# Altium project PMP20873E1.PrjPcb (part 3 of 4)
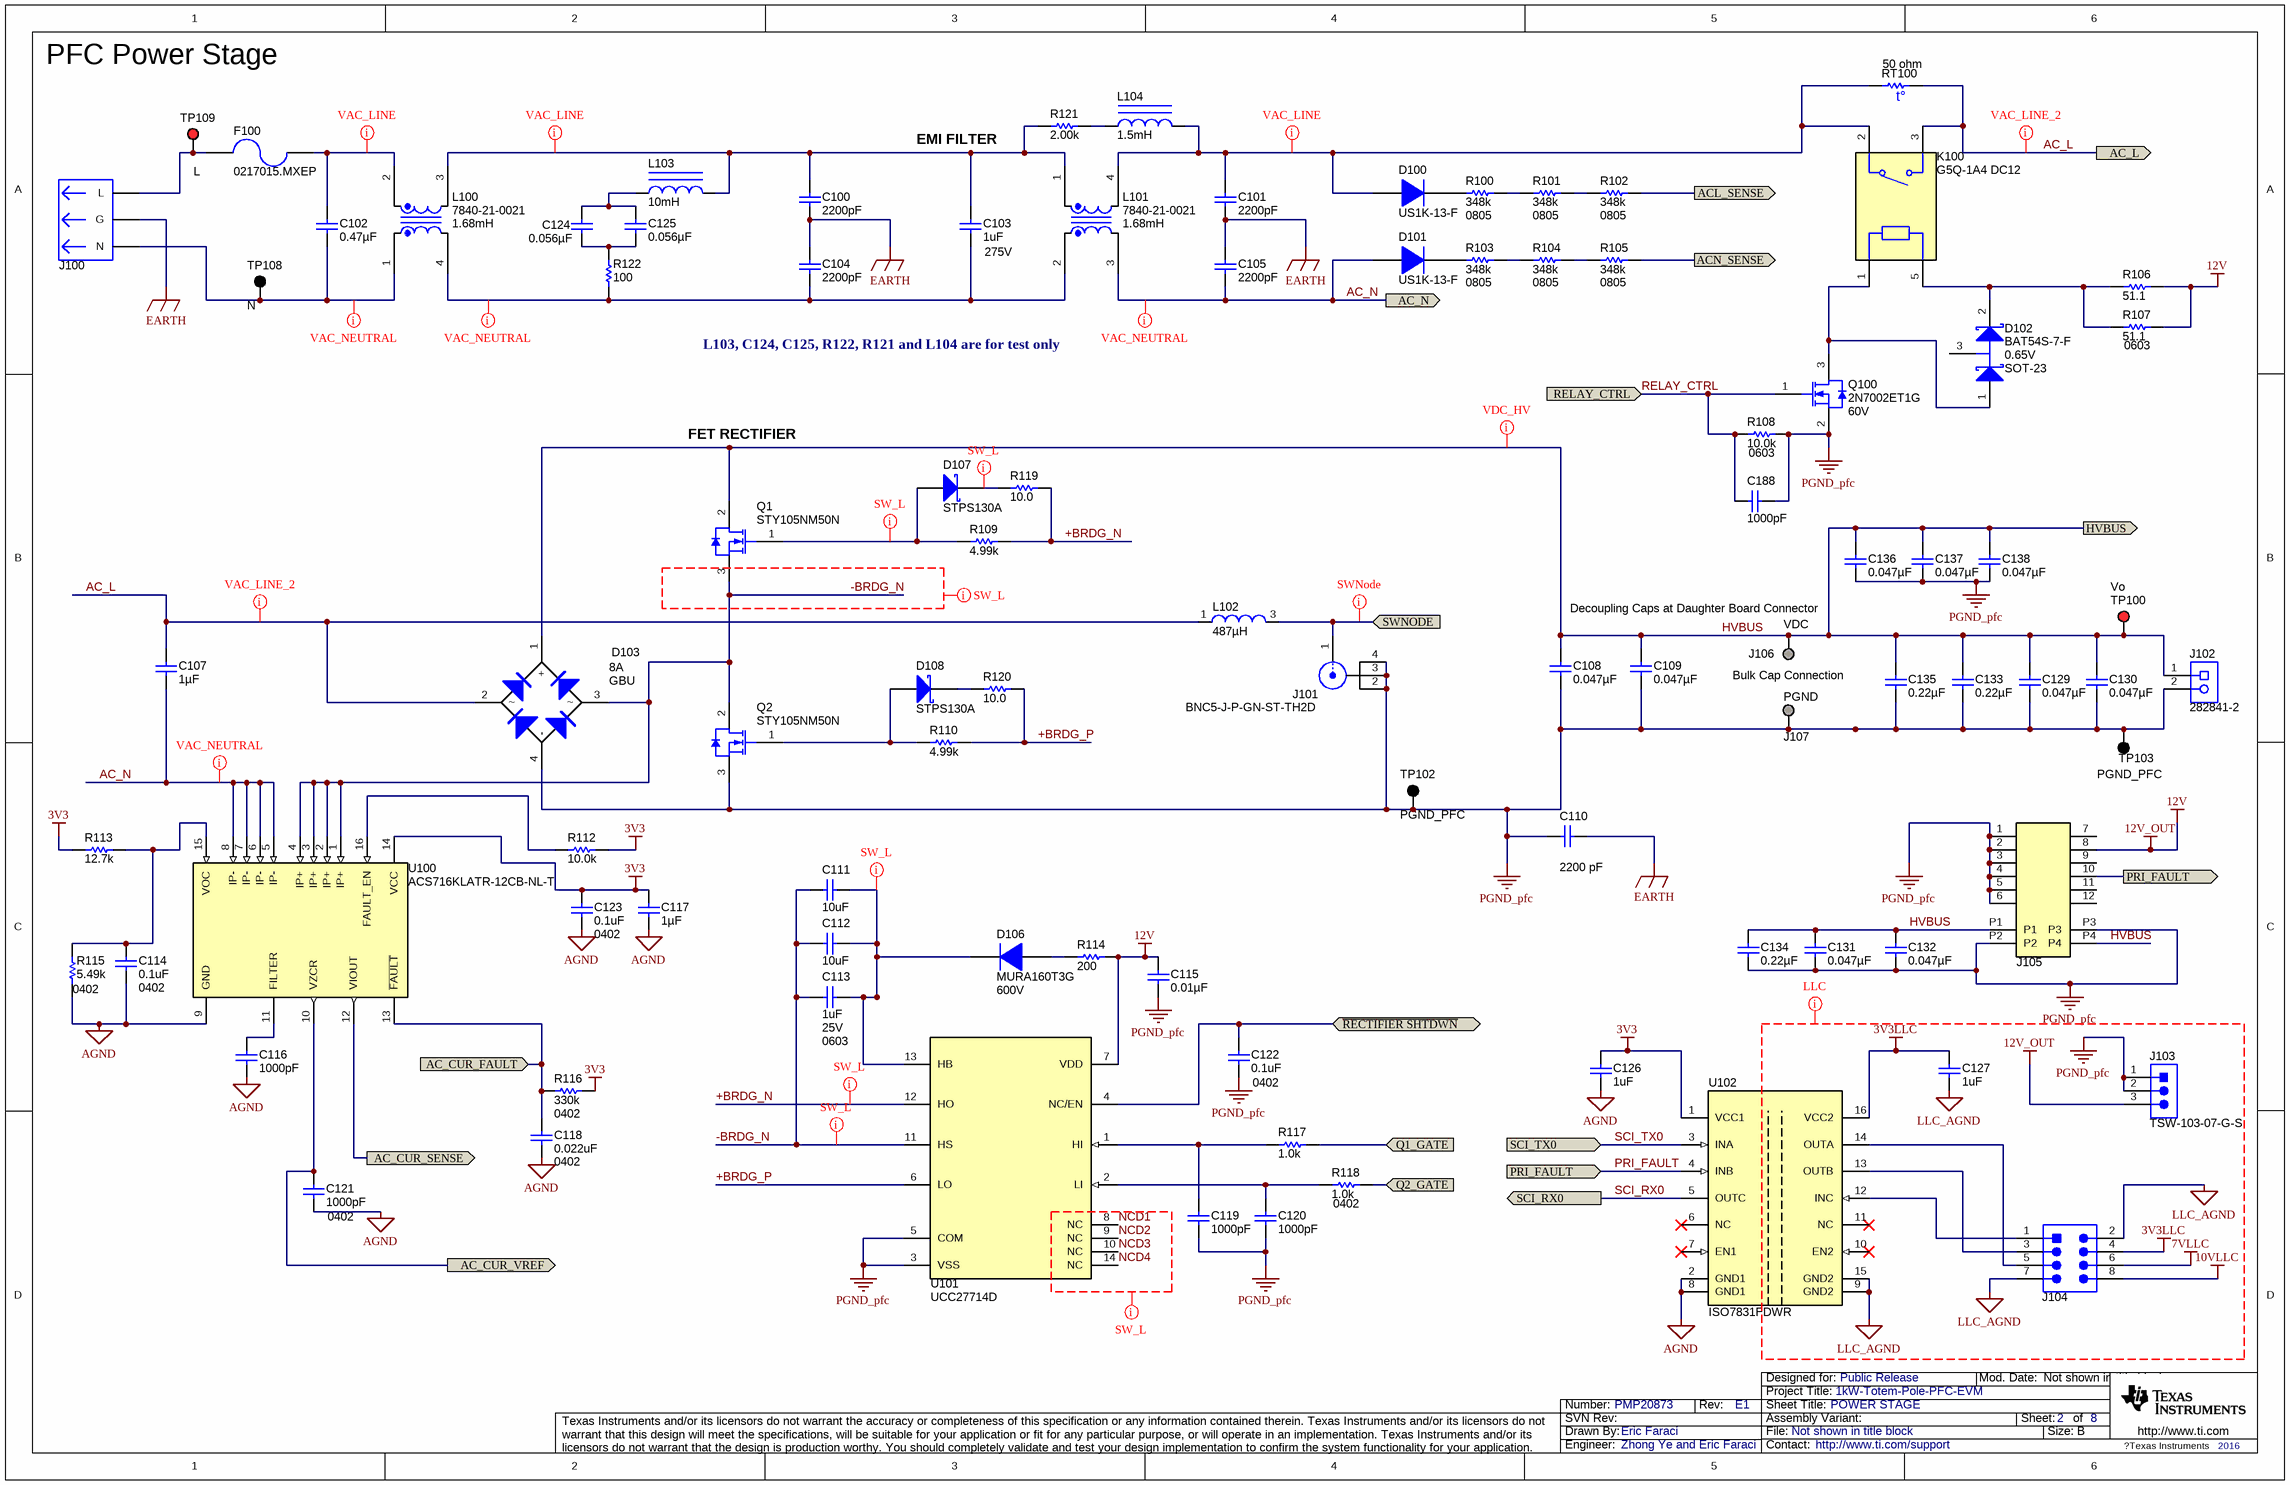
[diagram p4: PMP20873E1_Power.SchDoc]

## Sheet PMP20873E1_Power.SchDoc: POWER STAGE (continued)

### Parts
C100  ValueDisplayed: 2200pF  [CAPRD500W60D800H850]  (hidden comment: DE2E3KY222MA2BM01)
C101  ValueDisplayed: 2200pF  [CAPRD500W60D800H850]  (hidden comment: DE2E3KY222MA2BM01)
C102  ValueDisplayed: 0.47µF  [CAPRR2250W80L2550T850H1750]  (hidden comment: ECQ-U2A474ML)
C103  Value2: 275V  ValueDisplayed: 1uF  [CAPRR2250W80L2550T850H1750]  (hidden comment: R46KN-4100--P1 M)
C104  ValueDisplayed: 2200pF  [CAPRD500W60D800H850]  (hidden comment: DE2E3KY222MA2BM01)
C105  ValueDisplayed: 2200pF  [CAPRD500W60D800H850]  (hidden comment: DE2E3KY222MA2BM01)
C107  ValueDisplayed: 1µF  [MPK_1800x950]  (hidden comment: 450MPK105J)
C108  ValueDisplayed: 0.047µF  [1210]  (hidden comment: GRM32DR72J473KW01L)
C109  ValueDisplayed: 0.047µF  [1210]  (hidden comment: GRM32DR72J473KW01L)
C110  value 2200 pF  [CAPRD1000W60D900H1200]  (hidden comment: C921U222MYWDBA7317)
C111  ValueDisplayed: 10uF  [0805_HV]  (hidden comment: 0805YD106MAT2A)
C112  ValueDisplayed: 10uF  [0805_HV]  (hidden comment: 0805YD106MAT2A)
C113  ValueDisplayed: 1uF  Value2: 25V  [0603]  (hidden comment: C1608X7R1E105K080AB)
C114  ValueDisplayed: 0.1uF  [0402]  (hidden comment: GRM155R70J104KA01D)
C115  ValueDisplayed: 0.01µF  [0603]  (hidden comment: C0603X103K5RACTU)
C116  ValueDisplayed: 1000pF  [0603]  (hidden comment: C1608X7R1H102K)
C117  ValueDisplayed: 1µF  [0603]  (hidden comment: GRM185R60J105KE26D)
C118  ValueDisplayed: 0.022uF  [0402]  (hidden comment: GRM155R70J223KA01D)
C119  ValueDisplayed: 1000pF  [0402]  (hidden comment: C1005X7R1H102K)
C120  ValueDisplayed: 1000pF  [0402]  (hidden comment: GRM155R60J102KA01D)
C121  ValueDisplayed: 1000pF  [0402]  (hidden comment: GRM155R60J102KA01D)
C122  ValueDisplayed: 0.1uF  [0402]  (hidden comment: GRM155R70J104KA01D)
C123  ValueDisplayed: 0.1uF  [0402]  (hidden comment: GRM155R70J104KA01D)
C124  ValueDisplayed: 0.056µF  [2220_330_N]  (hidden comment: GA355XR7GB563KW06L)
C125  ValueDisplayed: 0.056µF  [2220_330_N]  (hidden comment: GA355XR7GB563KW06L)
C126  ValueDisplayed: 1uF  [0603]  (hidden comment: C1608X7R1E105K080AB)
C127  ValueDisplayed: 1uF  [0603]  (hidden comment: C1608X7R1E105K080AB)
C129  ValueDisplayed: 0.047µF  [1210]  (hidden comment: GRM32DR72J473KW01L)
C130  ValueDisplayed: 0.047µF  [1210]  (hidden comment: GRM32DR72J473KW01L)
C131  ValueDisplayed: 0.047µF  [1210]  (hidden comment: GRM32DR72J473KW01L)
C132  ValueDisplayed: 0.047µF  [1210]  (hidden comment: GRM32DR72J473KW01L)
C133  ValueDisplayed: 0.22µF  [2220]  (hidden comment: GRM55DR72J224KW01L)
C134  ValueDisplayed: 0.22µF  [2220]  (hidden comment: GRM55DR72J224KW01L)
C135  ValueDisplayed: 0.22µF  [2220]  (hidden comment: GRM55DR72J224KW01L)
C136  ValueDisplayed: 0.047µF  [1210]  (hidden comment: GRM32DR72J473KW01L)
C137  ValueDisplayed: 0.047µF  [1210]  (hidden comment: GRM32DR72J473KW01L)
C138  ValueDisplayed: 0.047µF  [1210]  (hidden comment: GRM32DR72J473KW01L)
C188  ValueDisplayed: 1000pF  [0603]  (hidden comment: GRM188R71C102KA01D)
D100  US1K-13-F  [SMA]
D101  US1K-13-F  [SMA]
D102  BAT54S-7-F  value 0.65V  [SOT-23]
D103  Value1: 8A  [GBU]  (hidden comment: GBU8J-BP)
D106  MURA160T3G  value 600V  [SMA]
D107  STPS130A  [SMA]
D108  STPS130A  [SMA]
F100  0217015.MXEP  [Fuse_217_015_Verical]
J100  703W-00/54  [CONN_QUALTEK-703W-0054]  (value not drawn)
J101  BNC5-J-P-GN-ST-TH2D  [Samtec_BNC5-J-P-GN-ST-TH2D]
J102  282841-2  [TEC_282841-2]
J103  TSW-103-07-G-S  [TSW-103-07-G-S]
J104  TSW-104-07-G-D  [TSW-104-07-G-D]  (value not drawn)
J105  PESC-02-12-02-01-L-RA-LC  [Samtec_PESC-02-12-02-01-x-RA-LC]  (value not drawn)
J106  VDC  [Mill-Max_0312-0-15-15-34-27-10-0]
J107  PGND  [Mill-Max_0312-0-15-15-34-27-10-0]
K100  G5Q-1A4 DC12  [Relay_G5Q-1A4]
L100  7840-21-0021  ValueDisplayed: 1.68mH  [7840-21-0021]
L101  7840-21-0021  ValueDisplayed: 1.68mH  [7840-21-0021]
L102  ValueDisplayed: 487µH  [IND_7840-09-0014]  (hidden comment: G164005LF)
L103  ValueDisplayed: 10mH  [ASPI-0403S]  (hidden comment: ASPI-0403S-103M-T)
L104  ValueDisplayed: 1.5mH  [LQH43M]  (hidden comment: LQH43MN152K03L)
Q1  STY105NM50N  [TO-247]
Q2  STY105NM50N  [TO-247]
Q100  2N7002ET1G  value 60V  [SOT-23]
R100  value 348k  PackageReference: 0805  [0805_HV]  (hidden comment: RT0805BRD07348KL)
R101  value 348k  PackageReference: 0805  [0805_HV]  (hidden comment: RT0805BRD07348KL)
R102  value 348k  PackageReference: 0805  [0805_HV]  (hidden comment: RT0805BRD07348KL)
R103  value 348k  PackageReference: 0805  [0805_HV]  (hidden comment: RT0805BRD07348KL)
R104  value 348k  PackageReference: 0805  [0805_HV]  (hidden comment: RT0805BRD07348KL)
R105  value 348k  PackageReference: 0805  [0805_HV]  (hidden comment: RT0805BRD07348KL)
R106  value 51.1  [0603]  (hidden comment: CRCW060351R1FKEA)
R107  value 51.1  [0603]  (hidden comment: CRCW060351R1FKEA)
R108  value 10.0k  [0603]  (hidden comment: RC0603FR-0710KL)
R109  ValueDisplayed: 4.99k  [0805_HV]  (hidden comment: ERJ-6ENF4991V)
R110  ValueDisplayed: 4.99k  [0805_HV]  (hidden comment: ERJ-6ENF4991V)
R112  value 10.0k  [0402]  (hidden comment: CRCW040210K0FKED)
R113  value 12.7k  [0402]  (hidden comment: CRCW040212K7FKED)
R114  value 200  [0603]  (hidden comment: CRCW0603200RFKEA)
R115  value 5.49k  [0402]  (hidden comment: CRCW04025K49FKED)
R116  value 330k  [0402]  (hidden comment: CRCW0402330KJNED)
R117  value 1.0k  [0402]  (hidden comment: CRCW04021K00JNED)
R118  value 1.0k  [0402]  (hidden comment: CRCW04021K00JNED)
R119  ValueDisplayed: 10.0  [0805_HV]  (hidden comment: CRCW080510R0FKEA)
R120  ValueDisplayed: 10.0  [0805_HV]  (hidden comment: CRCW080510R0FKEA)
R121  ValueDisplayed: 2.00k  [1206]  (hidden comment: CRCW12062K00FKEA)
R122  ValueDisplayed: 100  [1206]  (hidden comment: CRCW1206100RFKEA)
RT100  value 50 ohm  [TDK_B751]  (hidden comment: B59751B0120A070)
TP100  Vo  [Keystone5000]
TP102  PGND_PFC  [Keystone5001]
TP103  PGND_PFC  [Keystone5001]
TP108  N  [Keystone5001]
TP109  L  [Keystone5000]
U100  ACS716KLATR-12CB-NL-T  [SOIC-16]
U101  UCC27714D  [D0014A_N]
U102  ISO7831FDWR  [DW0016B_N]

### Ports
AC_CUR_FAULT, AC_CUR_SENSE, AC_CUR_VREF, AC_L, AC_N, ACL_SENSE, ACN_SENSE, HVBUS, PRI_FAULT (in), PRI_FAULT (out), Q1_GATE (in), Q2_GATE (in), RELAY_CTRL, SCI_RX0, SCI_TX0 (in), SWNODE, ~{RECTIFIER SHTDWN} (bidir)

### Nets
3V3: C117.1 C123.1 C126.2 R112.2 R113.2 R116.1 U100.14(VCC) U102.1(VCC1)
3V3LLC: C127.2 J104.4 U102.16(VCC2)
7VLLC: J104.6
10VLLC: J104.8
12V: C115.1 J103.3 J105.8 R106.2 R107.2 R114.2 U101.7(VDD)  [also labelled 12V_OUT]
AGND: C114.2 C116.2 C117.2 C118.1 C121.2 C123.2 C126.1 R115.1 U100.9(GND) U102.2(GND1) U102.8(GND1)
EARTH: C100.2 C101.2 C104.1 C105.1 C110.1 J100.3(G)
LLC_AGND: C127.1 J104.2 J104.7 U102.9(GND2) U102.15(GND2)
PGND_pfc: C108.2 C109.2 C110.2 C115.2 C119.2 C120.2 C122.2 C129.2 C130.2 C131.2 C132.2 C133.1 C134.2 C135.1 C136.2 C137.2 C138.2 C188.1 D103.4(-) J101.2 J101.3 J101.4 J102.2 J103.1 J103.2 J105.1 J105.2 J105.3 J105.4 J105.5 J105.6 J105.P2 J105.P3 J107.1 Q2.3(S) Q100.2(S) R108.2 TP102.1 TP103.1 U101.3(VSS) U101.5(COM)
+BRDG_N: R109.2 R119.2 U101.12(HO)
+BRDG_P: R110.2 R120.2 U101.6(LO)
-BRDG_N: C111.2 C112.2 C113.1 D103.3 Q1.3(S) Q2.2(D) U100.1(IP+) U100.2(IP+) U100.3(IP+) U100.4(IP+) U101.11(HS)
~{RECTIFIER SHTDWN}: C122.1 U101.4(NC/EN) ; port ~{RECTIFIER SHTDWN}
AC_CUR_FAULT: C118.2 R116.2 U100.13(~{FAULT}) ; port AC_CUR_FAULT
AC_CUR_SENSE: U100.12(VIOUT) ; port AC_CUR_SENSE
AC_CUR_VREF: C121.1 U100.10(VZCR) ; port AC_CUR_VREF
AC_L: C107.1 D103.2 K100.3 L102.1 RT100.2 ; port AC_L
AC_N: C105.2 C107.2 D101.2(A) L101.3 U100.5(IP-) U100.6(IP-) U100.7(IP-) U100.8(IP-) ; port AC_N
ACL_SENSE: R102.1 ; port ACL_SENSE
ACN_SENSE: R105.1 ; port ACN_SENSE
HVBUS: C108.1 C109.1 C129.1 C130.1 C131.1 C132.1 C133.2 C134.1 C135.2 C136.1 C137.1 C138.1 D103.1(+) J102.1 J105.P1 J105.P4 J106.1 Q1.2(D) TP100.1 ; port HVBUS
NCD1: U101.8(NC)
NCD2: U101.9(NC)
NCD3: U101.10(NC)
NCD4: U101.14(NC)
PRI_FAULT: J105.10 U102.4(INB) ; port PRI_FAULT
Q1_GATE: R117.2 ; port Q1_GATE
Q2_GATE: R118.2 ; port Q2_GATE
RELAY_CTRL: C188.2 Q100.1(G) R108.1 ; port RELAY_CTRL
SCI_RX0: U102.5(OUTC) ; port SCI_RX0
SCI_TX0: U102.3(INA) ; port SCI_TX0
SWNODE: J101.1 L102.3 ; port SWNODE
NetC100_1: C100.1 C103.1 L100.3 L101.1 L103.2 R121.1
NetC101_1: C101.1 D100.2(A) K100.2 L101.4 L104.2 RT100.1
NetC102_1: C102.1 F100.2 L100.2
NetC102_2: C102.2 J100.2(N) L100.1 TP108.1
NetC103_2: C103.2 C104.2 L100.4 L101.2 R122.1
NetC111_1: C111.1 C112.1 C113.2 D106.1(K) U101.13(HB)
NetC114_1: C114.1 R113.1 R115.2 U100.15(VOC)
NetC116_1: C116.1 U100.11(FILTER)
NetC119_1: C119.1 R117.1 U101.1(HI)
NetC120_1: C120.1 R118.1 U101.2(LI)
NetC124_1: C124.1 C125.1 L103.1
NetC124_2: C124.2 C125.2 R122.2
NetD100_1: D100.1(K) R100.2
NetD101_1: D101.1(K) R103.2
NetD102_1: D102.1(A) K100.1 Q100.3(D)
NetD102_2: D102.2(K) K100.5 R106.1 R107.1
NetD106_2: D106.2(A) R114.1
NetD107_1: D107.1(K) R119.1
NetD107_2: D107.2(A) Q1.1(G) R109.1
NetD108_1: D108.1(K) R120.1
NetD108_2: D108.2(A) Q2.1(G) R110.1
NetF100_1: F100.1 J100.1(L) TP109.1
NetJ104_1: J104.1 U102.12(INC)
NetJ104_3: J104.3 U102.13(OUTB)
NetJ104_5: J104.5 U102.14(OUTA)
NetL104_1: L104.1 R121.2
NetR100_1: R100.1 R101.2
NetR101_1: R101.1 R102.2
NetR103_1: R103.1 R104.2
NetR104_1: R104.1 R105.2
NetR112_1: R112.1 U100.16(FAULT_EN)

Not connected (* = marked no-connect by the designer): D102 3(C); J105 7 9 11 12; U102 6(NC)* 7(EN1)* 10(EN2)* 11(NC)*

### Layout directives
net class VAC_NEUTRAL: AC_N, NetC102_2, NetC103_2
net class VAC_LINE: NetC100_1, NetC101_1, NetC102_1
net class VAC_LINE_2: AC_L
net class SW_L: +BRDG_N, -BRDG_N, NCD1, NCD2, NCD3, NCD4, NetC111_1, NetD107_1, NetD107_2
net class LLC: 3V3LLC, 7VLLC, 10VLLC, 12V_OUT, LLC_AGND, PGND_pfc
net class VDC_HV: HVBUS
net class SWNode: SWNODE

### Notes on the sheet
- PFC Power Stage
- EMI FILTER
- L103, C124, C125, R122, R121 and L104 are for test only
- FET RECTIFIER
- Decoupling Caps at Daughter Board Connector
- Bulk Cap Connection
- Drawn By:
- SVN Rev:
- Number:
- Rev:
- Sheet Title:
- File:
- Project Title:
- Designed for:
- Assembly Variant:
- Mod. Date:
- Sheet:
- Size:
- of
- B
- http://www.ti.com
- Texas Instruments and/or its licensors do not warrant the accuracy or completeness of this specification or any information contained therein. Texas Instruments and/or its licensors do not warrant that this design will meet the specifications, will be suitable for your application or fit for any particular purpose, or will operate in an implementation. Texas Instruments and/or its licensors do not warrant that the design is production worthy. You should completely validate and test your design implementation to confirm the system functionality for your application.
- Engineer:
- Contact:
- ?Texas Instruments
- (in symbol B59751B0120A070) t°